# EAGLE schematic cpu_module (EAGLE 6.4)

## Sheet 1 of 3: Power Supply
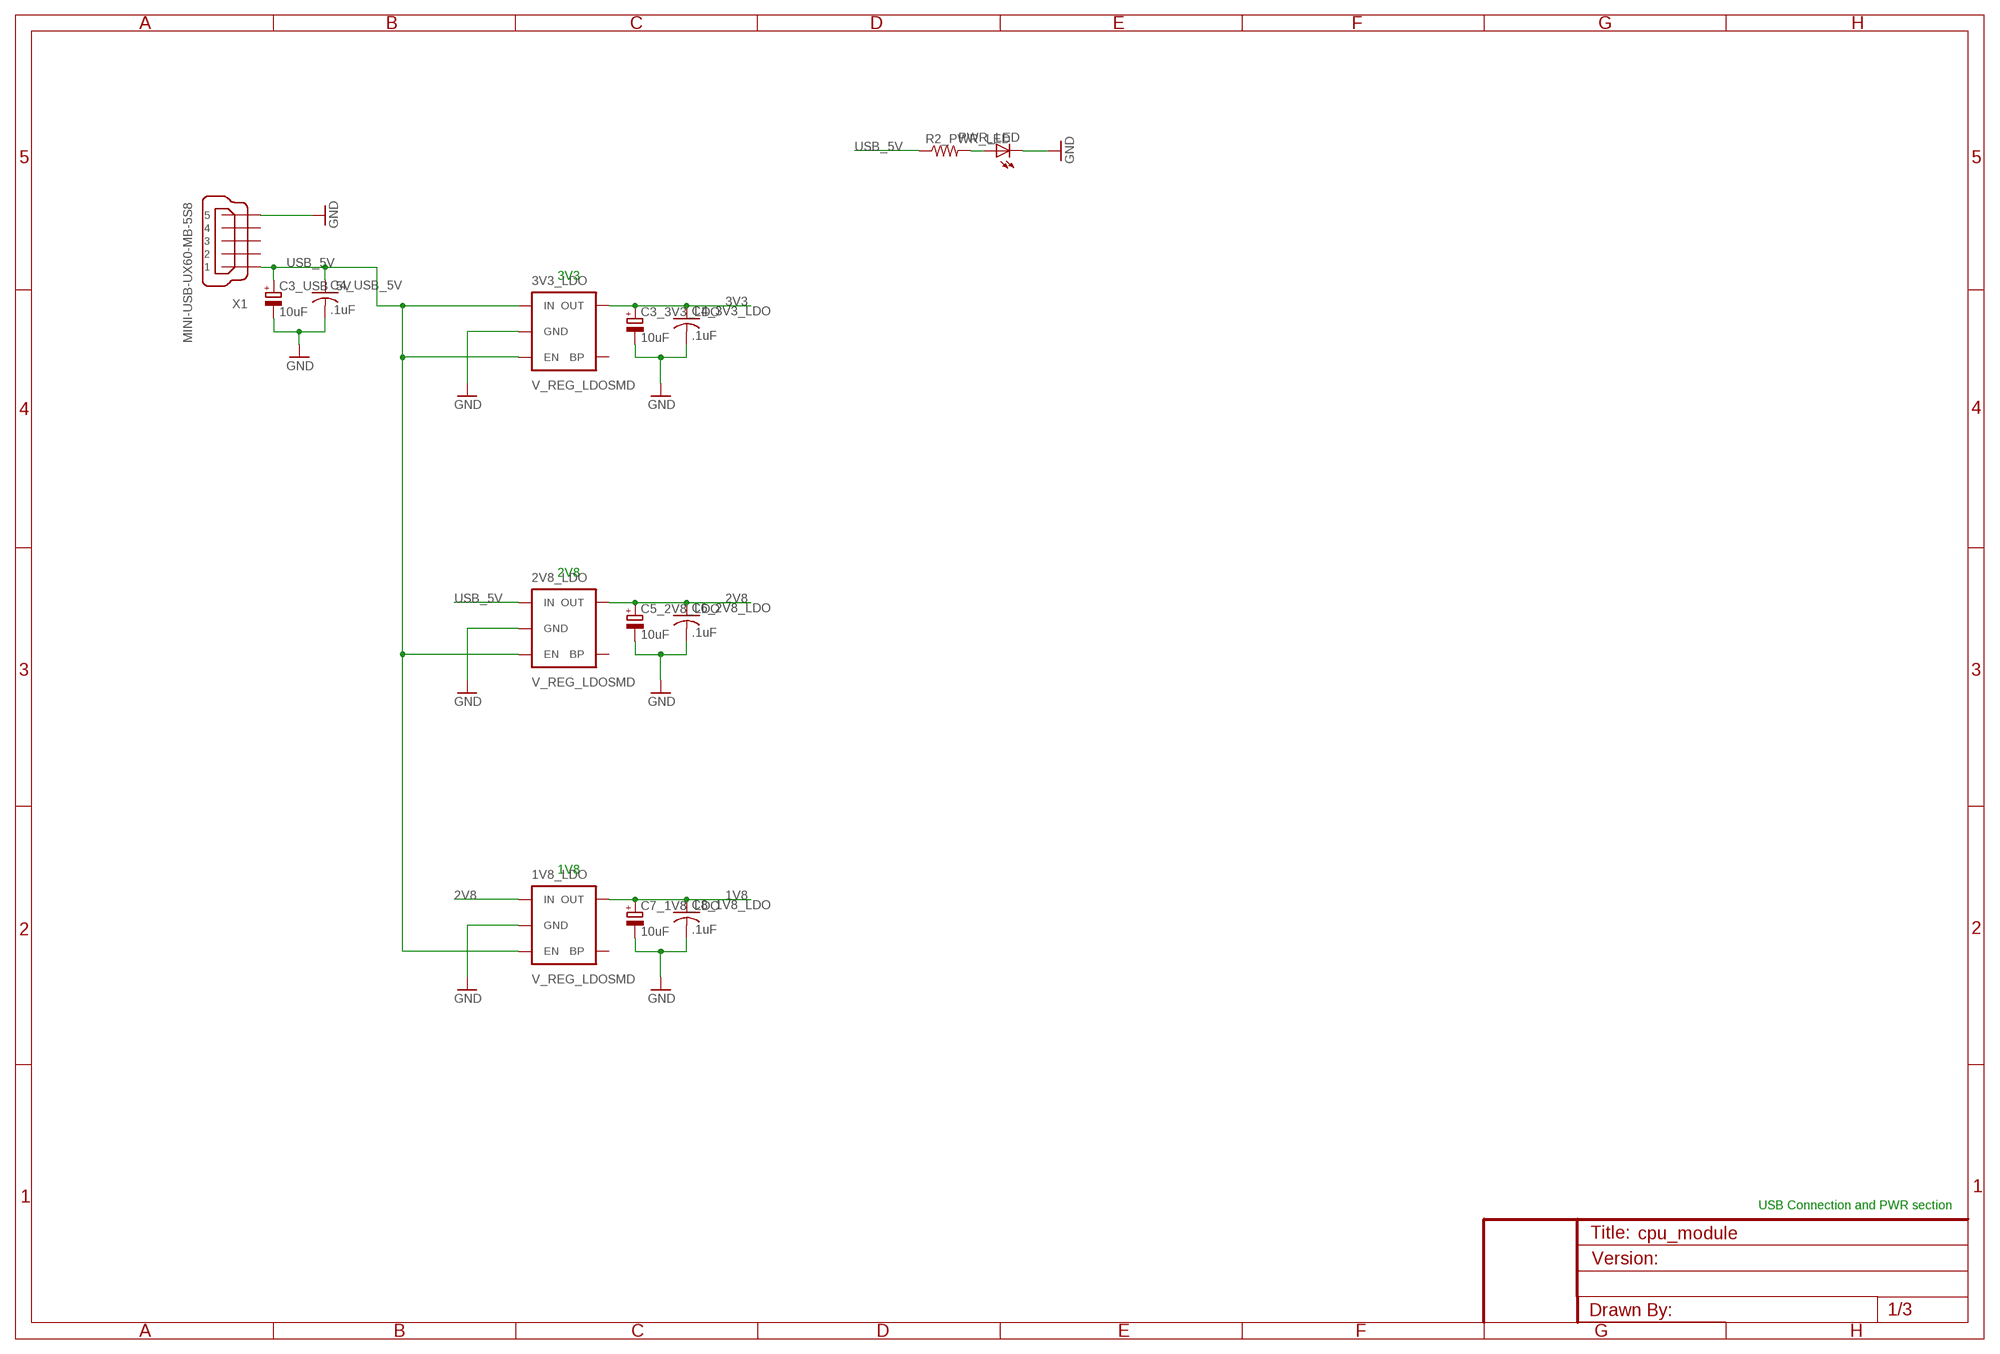
[diagram p0: schematic, sheet 1]

### Parts
1V8_LDO  V_REG_LDOSMD  [SOT23-5]
2V8_LDO  V_REG_LDOSMD  [SOT23-5]
3V3_LDO  V_REG_LDOSMD  [SOT23-5]
C3_3V3_LDO  10uF  CAPACITOR_POL-SMC_A  [SMC_A]
C3_USB_5V  10uF  CAPACITOR_POL-SMC_A  [SMC_A]
C4_3V3_LDO  .1uF  C-USC0402  [C0402]
C4_USB_5V  .1uF  C-USC0402  [C0402]
C5_2V8_LDO  10uF  CAPACITOR_POL-SMC_A  [SMC_A]
C6_2V8_LDO  .1uF  C-USC0402  [C0402]
C7_1V8_LDO  10uF  CAPACITOR_POL-SMC_A  [SMC_A]
C8_1V8_LDO  .1uF  C-USC0402  [C0402]
PWR_LED  LEDCHIP-LED0603  [CHIP-LED0603]
R2_PWR_LED  RESISTOR0402-RES  [0402-RES]
X1  MINI-USB-UX60-MB-5S8  [UX60-MB-5S8]

### Nets
1V8: 1V8_LDO.5(OUT) C7_1V8_LDO.+ C8_1V8_LDO.1 ; also sheet 3
2V8: 1V8_LDO.1(IN) 2V8_LDO.5(OUT) C5_2V8_LDO.+ C6_2V8_LDO.1 ; also sheet 3
3V3: 3V3_LDO.5(OUT) C3_3V3_LDO.+ C4_3V3_LDO.1 ; also sheet 2,3
GND: 1V8_LDO.2(GND) 2V8_LDO.2(GND) 3V3_LDO.2(GND) C3_3V3_LDO.- C3_USB_5V.- C4_3V3_LDO.2 C4_USB_5V.2 C5_2V8_LDO.- C6_2V8_LDO.2 C7_1V8_LDO.- C8_1V8_LDO.2 PWR_LED.C X1.5 ; also sheet 2,3
N$1: PWR_LED.A R2_PWR_LED.2
USB_5V: 1V8_LDO.3(EN) 2V8_LDO.1(IN) 2V8_LDO.3(EN) 3V3_LDO.1(IN) 3V3_LDO.3(EN) C3_USB_5V.+ C4_USB_5V.1 R2_PWR_LED.1 X1.1 ; also sheet 3
Unconnected: 1V8_LDO.4(BP) 2V8_LDO.4(BP) 3V3_LDO.4(BP) X1.2 X1.3 X1.4

### Notes on the sheet
- 3V3
- 2V8
- 1V8
- USB Connection and PWR section

## Sheet 2 of 3: STM32F439IIT
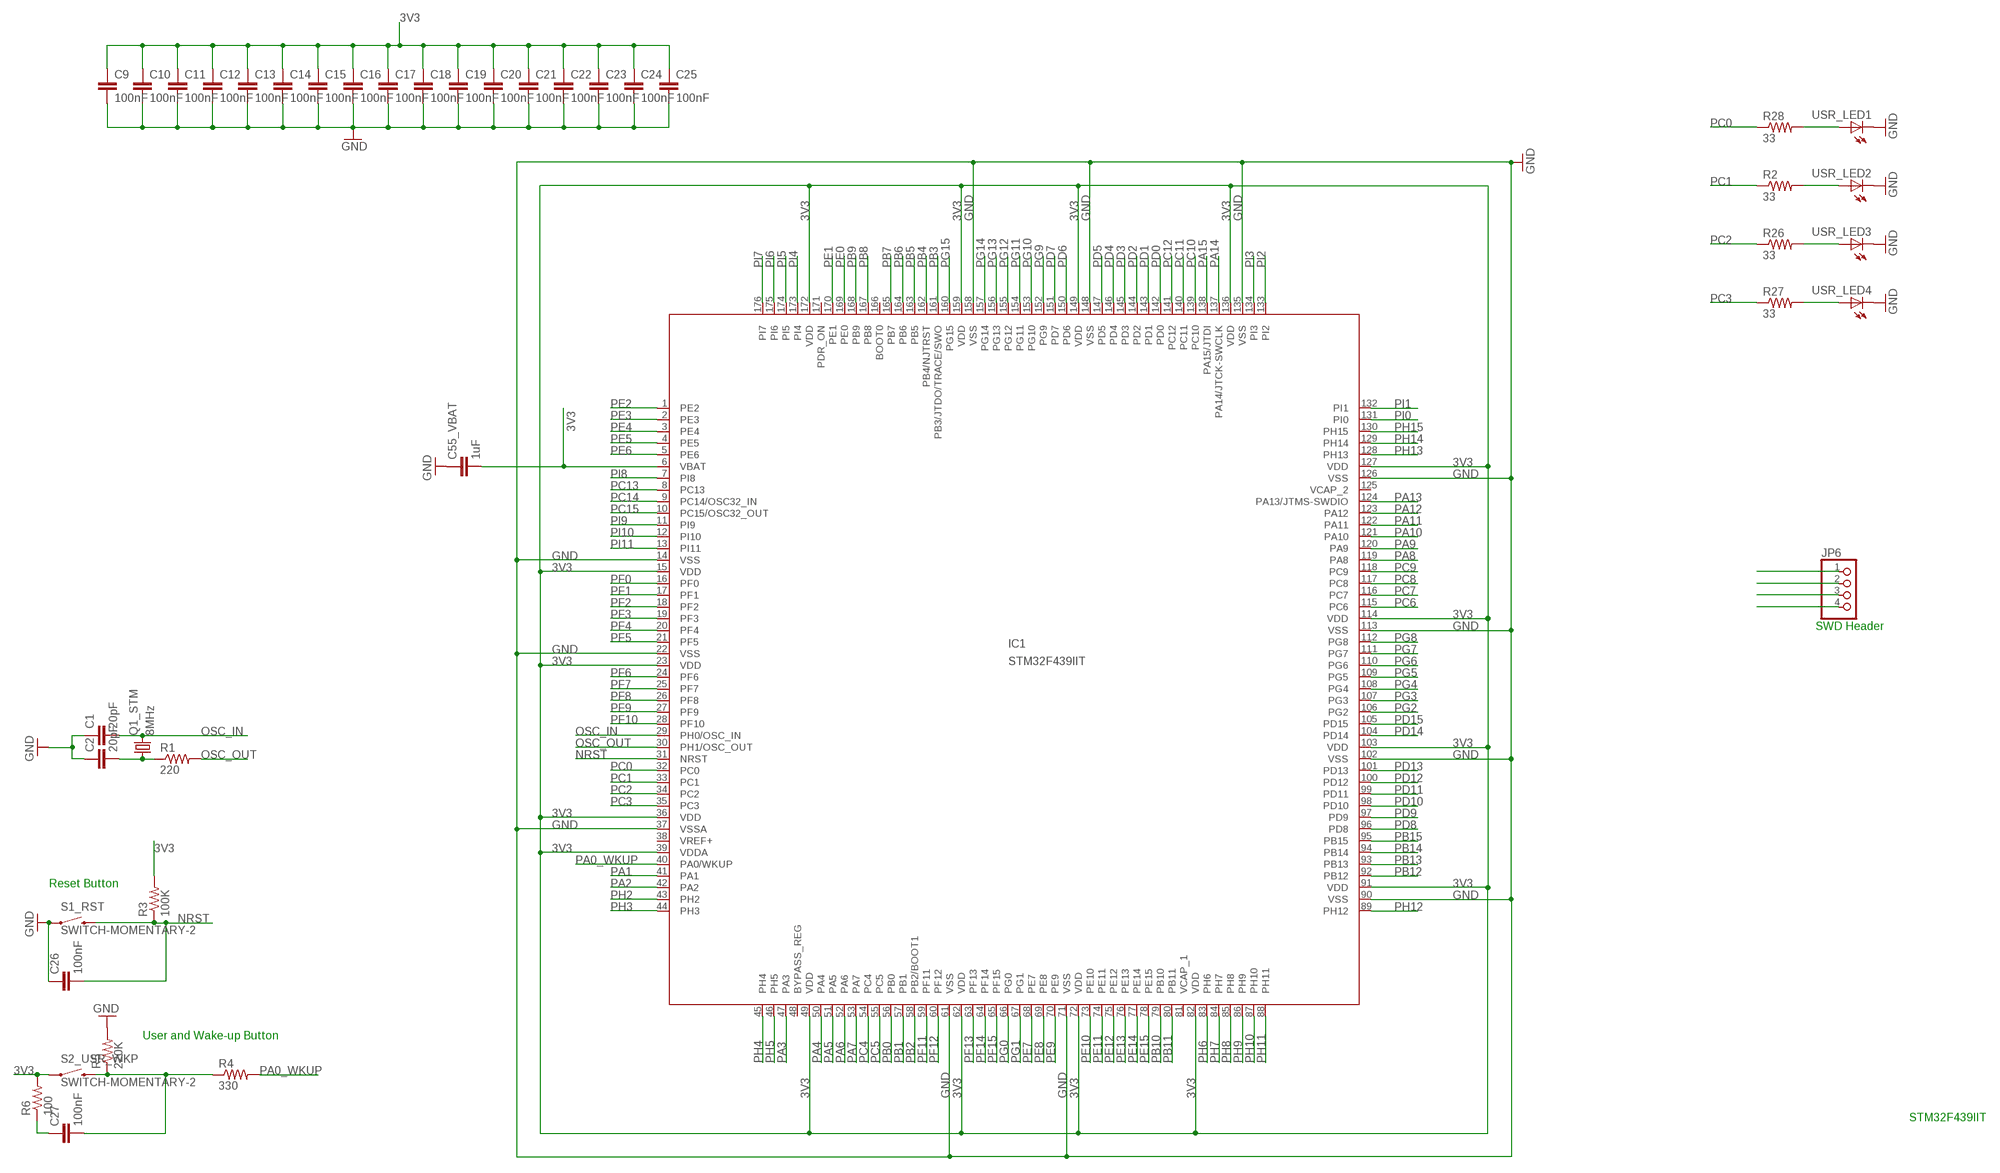
[diagram p1: schematic, sheet 2]

### Parts
C1  20pF  C-EUC0402  [C0402]
C2  20pF  C-EUC0402  [C0402]
C9  100nF  C-EUC0402  [C0402]
C10  100nF  C-EUC0402  [C0402]
C11  100nF  C-EUC0402  [C0402]
C12  100nF  C-EUC0402  [C0402]
C13  100nF  C-EUC0402  [C0402]
C14  100nF  C-EUC0402  [C0402]
C15  100nF  C-EUC0402  [C0402]
C16  100nF  C-EUC0402  [C0402]
C17  100nF  C-EUC0402  [C0402]
C18  100nF  C-EUC0402  [C0402]
C19  100nF  C-EUC0402  [C0402]
C20  100nF  C-EUC0402  [C0402]
C21  100nF  C-EUC0402  [C0402]
C22  100nF  C-EUC0402  [C0402]
C23  100nF  C-EUC0402  [C0402]
C24  100nF  C-EUC0402  [C0402]
C25  100nF  C-EUC0402  [C0402]
C26  100nF  C-EUC0402  [C0402]
C27  100nF  C-EUC0402  [C0402]
C55_VBAT  1uF  C-EUC0402  [C0402]
IC1  STM32F439IIT  [LQFP-176]
JP6  PINHD-1X4/90  [1X04/90]
Q1_STM  8MHz  CRYSTALCTS406  [CTS406]
R1  220  RESISTOR0402-RES  [0402-RES]
R2  33  RESISTOR0402-RES  [0402-RES]
R3  100K  RESISTOR0402-RES  [0402-RES]
R4  330  RESISTOR0402-RES  [0402-RES]
R5  220K  RESISTOR0402-RES  [0402-RES]
R6  100  RESISTOR0402-RES  [0402-RES]
R26  33  RESISTOR0402-RES  [0402-RES]
R27  33  RESISTOR0402-RES  [0402-RES]
R28  33  RESISTOR0402-RES  [0402-RES]
S1_RST  SWITCH-MOMENTARY-2  [TACTILE_SWITCH_TALL]
S2_USR_WKP  SWITCH-MOMENTARY-2  [TACTILE_SWITCH_TALL]
USR_LED1  LEDCHIPLED_0805  [CHIPLED_0805]
USR_LED2  LEDCHIPLED_0805  [CHIPLED_0805]
USR_LED3  LEDCHIPLED_0805  [CHIPLED_0805]
USR_LED4  LEDCHIPLED_0805  [CHIPLED_0805]

### Nets
3V3: C9.1 C10.1 C11.1 C12.1 C13.1 C14.1 C15.1 C16.1 C17.1 C18.1 C19.1 C20.1 C21.1 C22.1 C23.1 C24.1 C25.1 C55_VBAT.2 IC1.6(VBAT) IC1.15(VDD) IC1.23(VDD) IC1.36(VDD) IC1.39(VDDA) IC1.49(VDD) IC1.62(VDD) IC1.72(VDD) IC1.82(VDD) IC1.91(VDD) IC1.103(VDD) IC1.114(VDD) IC1.127(VDD) IC1.136(VDD) IC1.149(VDD) IC1.159(VDD) IC1.172(VDD) R3.2 R6.2 S2_USR_WKP.A2 ; also sheet 1,3
GND: C1.1 C2.1 C9.2 C10.2 C11.2 C12.2 C13.2 C14.2 C15.2 C16.2 C17.2 C18.2 C19.2 C20.2 C21.2 C22.2 C23.2 C24.2 C25.2 C26.1 C55_VBAT.1 IC1.14(VSS) IC1.22(VSS) IC1.37(VSSA) IC1.61(VSS) IC1.71(VSS) IC1.90(VSS) IC1.102(VSS) IC1.113(VSS) IC1.126(VSS) IC1.135(VSS) IC1.148(VSS) IC1.158(VSS) R5.2 S1_RST.A2 USR_LED1.C USR_LED2.C USR_LED3.C USR_LED4.C ; also sheet 1,3
N$2: C2.2 Q1_STM.1 R1.1
N$3: C27.2 R4.1 R5.1 S2_USR_WKP.B2
N$4: C27.1 R6.1
N$17: JP6.1
N$18: JP6.2
N$19: R28.2 USR_LED1.A
N$20: R2.2 USR_LED2.A
N$21: R26.2 USR_LED3.A
N$22: R27.2 USR_LED4.A
N$23: JP6.3
N$24: JP6.4
NRST: C26.2 IC1.31(NRST) R3.1 S1_RST.B2 ; also sheet 3
OSC_IN: C1.2 IC1.29(PH0/OSC_IN) Q1_STM.3
OSC_OUT: IC1.30(PH1/OSC_OUT) R1.2
PA0_WKUP: IC1.40(PA0/WKUP) R4.2
PA1: IC1.41(PA1) ; also sheet 3
PA2: IC1.42(PA2) ; also sheet 3
PA3: IC1.47(PA3) ; also sheet 3
PA4: IC1.50(PA4) ; also sheet 3
PA5: IC1.51(PA5) ; also sheet 3
PA6: IC1.52(PA6) ; also sheet 3
PA7: IC1.53(PA7) ; also sheet 3
PA8: IC1.119(PA8) ; also sheet 3
PA9: IC1.120(PA9) ; also sheet 3
PA10: IC1.121(PA10) ; also sheet 3
PA11: IC1.122(PA11) ; also sheet 3
PA12: IC1.123(PA12) ; also sheet 3
PA13: IC1.124(PA13/JTMS-SWDIO) ; also sheet 3
PA14: IC1.137(PA14/JTCK-SWCLK) ; also sheet 3
PA15: IC1.138(PA15/JTDI) ; also sheet 3
PB0: IC1.56(PB0) ; also sheet 3
PB1: IC1.57(PB1) ; also sheet 3
PB2: IC1.58(PB2/BOOT1) ; also sheet 3
PB3: IC1.161(PB3/JTDO/TRACE/SWO) ; also sheet 3
PB4: IC1.162(PB4/NJTRST) ; also sheet 3
PB5: IC1.163(PB5) ; also sheet 3
PB6: IC1.164(PB6) ; also sheet 3
PB7: IC1.165(PB7) ; also sheet 3
PB8: IC1.167(PB8) ; also sheet 3
PB9: IC1.168(PB9) ; also sheet 3
PB10: IC1.79(PB10) ; also sheet 3
PB11: IC1.80(PB11) ; also sheet 3
PB12: IC1.92(PB12) ; also sheet 3
PB13: IC1.93(PB13) ; also sheet 3
PB14: IC1.94(PB14) ; also sheet 3
PB15: IC1.95(PB15) ; also sheet 3
PC0: IC1.32(PC0) R28.1 ; also sheet 3
PC1: IC1.33(PC1) R2.1 ; also sheet 3
PC2: IC1.34(PC2) R26.1 ; also sheet 3
PC3: IC1.35(PC3) R27.1 ; also sheet 3
PC4: IC1.54(PC4) ; also sheet 3
PC5: IC1.55(PC5) ; also sheet 3
PC6: IC1.115(PC6) ; also sheet 3
PC7: IC1.116(PC7) ; also sheet 3
PC8: IC1.117(PC8) ; also sheet 3
PC9: IC1.118(PC9) ; also sheet 3
PC10: IC1.139(PC10) ; also sheet 3
PC11: IC1.140(PC11) ; also sheet 3
PC12: IC1.141(PC12) ; also sheet 3
PC13: IC1.8(PC13) ; also sheet 3
PC14: IC1.9(PC14/OSC32_IN) ; also sheet 3
PC15: IC1.10(PC15/OSC32_OUT) ; also sheet 3
PD0: IC1.142(PD0) ; also sheet 3
PD1: IC1.143(PD1) ; also sheet 3
PD2: IC1.144(PD2) ; also sheet 3
PD3: IC1.145(PD3) ; also sheet 3
PD4: IC1.146(PD4) ; also sheet 3
PD5: IC1.147(PD5) ; also sheet 3
PD6: IC1.150(PD6) ; also sheet 3
PD7: IC1.151(PD7) ; also sheet 3
PD8: IC1.96(PD8) ; also sheet 3
PD9: IC1.97(PD9) ; also sheet 3
PD10: IC1.98(PD10) ; also sheet 3
PD11: IC1.99(PD11) ; also sheet 3
PD12: IC1.100(PD12) ; also sheet 3
PD13: IC1.101(PD13) ; also sheet 3
PD14: IC1.104(PD14) ; also sheet 3
PD15: IC1.105(PD15) ; also sheet 3
PE0: IC1.169(PE0) ; also sheet 3
PE1: IC1.170(PE1) ; also sheet 3
PE2: IC1.1(PE2) ; also sheet 3
PE3: IC1.2(PE3) ; also sheet 3
PE4: IC1.3(PE4) ; also sheet 3
PE5: IC1.4(PE5) ; also sheet 3
PE6: IC1.5(PE6) ; also sheet 3
PE7: IC1.68(PE7) ; also sheet 3
PE8: IC1.69(PE8) ; also sheet 3
PE9: IC1.70(PE9) ; also sheet 3
PE10: IC1.73(PE10) ; also sheet 3
PE11: IC1.74(PE11) ; also sheet 3
PE12: IC1.75(PE12) ; also sheet 3
PE13: IC1.76(PE13) ; also sheet 3
PE14: IC1.77(PE14) ; also sheet 3
PE15: IC1.78(PE15) ; also sheet 3
PF0: IC1.16(PF0) ; also sheet 3
PF1: IC1.17(PF1) ; also sheet 3
PF2: IC1.18(PF2) ; also sheet 3
PF3: IC1.19(PF3) ; also sheet 3
PF4: IC1.20(PF4) ; also sheet 3
PF5: IC1.21(PF5) ; also sheet 3
PF6: IC1.24(PF6) ; also sheet 3
PF7: IC1.25(PF7) ; also sheet 3
PF8: IC1.26(PF8) ; also sheet 3
PF9: IC1.27(PF9) ; also sheet 3
PF10: IC1.28(PF10) ; also sheet 3
PF11: IC1.59(PF11) ; also sheet 3
PF12: IC1.60(PF12) ; also sheet 3
PF13: IC1.63(PF13) ; also sheet 3
PF14: IC1.64(PF14) ; also sheet 3
PF15: IC1.65(PF15) ; also sheet 3
PG0: IC1.66(PG0) ; also sheet 3
PG1: IC1.67(PG1) ; also sheet 3
PG2: IC1.106(PG2) ; also sheet 3
PG3: IC1.107(PG3) ; also sheet 3
PG4: IC1.108(PG4) ; also sheet 3
PG5: IC1.109(PG5) ; also sheet 3
PG6: IC1.110(PG6) ; also sheet 3
PG7: IC1.111(PG7) ; also sheet 3
PG8: IC1.112(PG8) ; also sheet 3
PG9: IC1.152(PG9) ; also sheet 3
PG10: IC1.153(PG10) ; also sheet 3
PG11: IC1.154(PG11) ; also sheet 3
PG12: IC1.155(PG12) ; also sheet 3
PG13: IC1.156(PG13) ; also sheet 3
PG14: IC1.157(PG14) ; also sheet 3
PG15: IC1.160(PG15) ; also sheet 3
PH2: IC1.43(PH2) ; also sheet 3
PH3: IC1.44(PH3) ; also sheet 3
PH4: IC1.45(PH4) ; also sheet 3
PH5: IC1.46(PH5) ; also sheet 3
PH6: IC1.83(PH6) ; also sheet 3
PH7: IC1.84(PH7) ; also sheet 3
PH8: IC1.85(PH8) ; also sheet 3
PH9: IC1.86(PH9) ; also sheet 3
PH10: IC1.87(PH10) ; also sheet 3
PH11: IC1.88(PH11) ; also sheet 3
PH12: IC1.89(PH12) ; also sheet 3
PH13: IC1.128(PH13) ; also sheet 3
PH14: IC1.129(PH14) ; also sheet 3
PH15: IC1.130(PH15) ; also sheet 3
PI0: IC1.131(PI0) ; also sheet 3
PI1: IC1.132(PI1) ; also sheet 3
PI2: IC1.133(PI2) ; also sheet 3
PI3: IC1.134(PI3) ; also sheet 3
PI4: IC1.173(PI4) ; also sheet 3
PI5: IC1.174(PI5) ; also sheet 3
PI6: IC1.175(PI6) ; also sheet 3
PI7: IC1.176(PI7) ; also sheet 3
PI8: IC1.7(PI8) ; also sheet 3
PI9: IC1.11(PI9) ; also sheet 3
PI10: IC1.12(PI10) ; also sheet 3
PI11: IC1.13(PI11) ; also sheet 3
Unconnected: IC1.48(BYPASS_REG) IC1.166(BOOT0)

### Notes on the sheet
- SWD Header
- Reset Button
- User and Wake-up Button
- STM32F439IIT

## Sheet 3 of 3: Header Pins
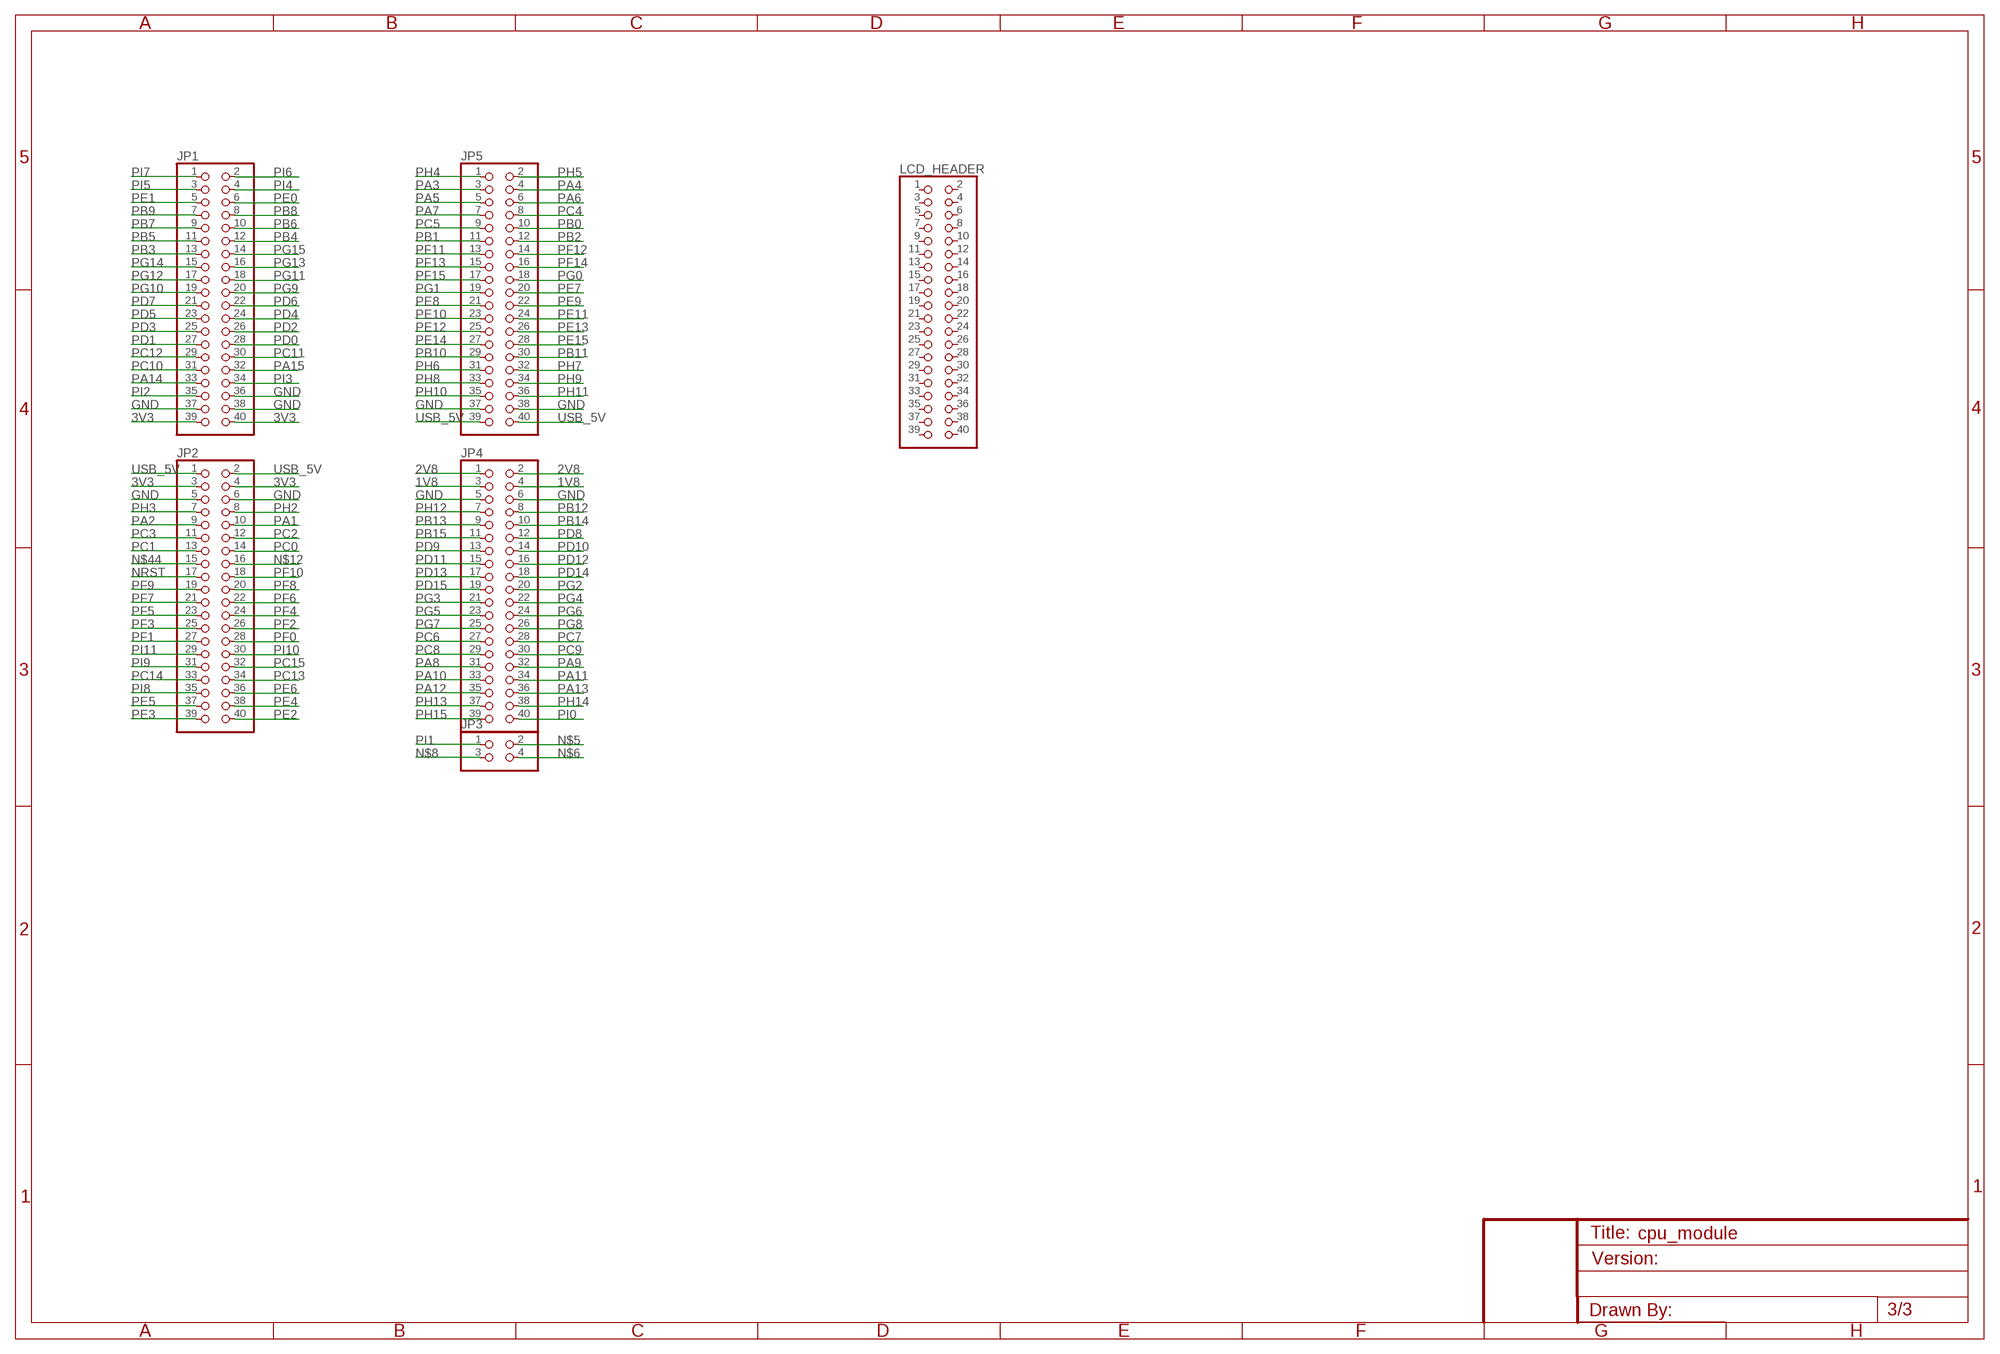
[diagram p2: schematic, sheet 3]

### Parts
JP1  PINHD-2X20  [2X20]
JP2  PINHD-2X20  [2X20]
JP3  PINHD-2X2  [2X02]
JP4  PINHD-2X20  [2X20]
JP5  PINHD-2X20  [2X20]
LCD_HEADER  PINHD-2X20  [2X20]

### Nets
1V8: JP4.3 JP4.4 ; also sheet 1
2V8: JP4.1 JP4.2 ; also sheet 1
3V3: JP1.39 JP1.40 JP2.3 JP2.4 ; also sheet 1,2
GND: JP1.36 JP1.37 JP1.38 JP2.5 JP2.6 JP4.5 JP4.6 JP5.37 JP5.38 ; also sheet 1,2
N$5: JP3.2
N$6: JP3.4
N$8: JP3.3
N$12: JP2.16
N$44: JP2.15
NRST: JP2.17 ; also sheet 2
PA1: JP2.10 ; also sheet 2
PA2: JP2.9 ; also sheet 2
PA3: JP5.3 ; also sheet 2
PA4: JP5.4 ; also sheet 2
PA5: JP5.5 ; also sheet 2
PA6: JP5.6 ; also sheet 2
PA7: JP5.7 ; also sheet 2
PA8: JP4.31 ; also sheet 2
PA9: JP4.32 ; also sheet 2
PA10: JP4.33 ; also sheet 2
PA11: JP4.34 ; also sheet 2
PA12: JP4.35 ; also sheet 2
PA13: JP4.36 ; also sheet 2
PA14: JP1.33 ; also sheet 2
PA15: JP1.32 ; also sheet 2
PB0: JP5.10 ; also sheet 2
PB1: JP5.11 ; also sheet 2
PB2: JP5.12 ; also sheet 2
PB3: JP1.13 ; also sheet 2
PB4: JP1.12 ; also sheet 2
PB5: JP1.11 ; also sheet 2
PB6: JP1.10 ; also sheet 2
PB7: JP1.9 ; also sheet 2
PB8: JP1.8 ; also sheet 2
PB9: JP1.7 ; also sheet 2
PB10: JP5.29 ; also sheet 2
PB11: JP5.30 ; also sheet 2
PB12: JP4.8 ; also sheet 2
PB13: JP4.9 ; also sheet 2
PB14: JP4.10 ; also sheet 2
PB15: JP4.11 ; also sheet 2
PC0: JP2.14 ; also sheet 2
PC1: JP2.13 ; also sheet 2
PC2: JP2.12 ; also sheet 2
PC3: JP2.11 ; also sheet 2
PC4: JP5.8 ; also sheet 2
PC5: JP5.9 ; also sheet 2
PC6: JP4.27 ; also sheet 2
PC7: JP4.28 ; also sheet 2
PC8: JP4.29 ; also sheet 2
PC9: JP4.30 ; also sheet 2
PC10: JP1.31 ; also sheet 2
PC11: JP1.30 ; also sheet 2
PC12: JP1.29 ; also sheet 2
PC13: JP2.34 ; also sheet 2
PC14: JP2.33 ; also sheet 2
PC15: JP2.32 ; also sheet 2
PD0: JP1.28 ; also sheet 2
PD1: JP1.27 ; also sheet 2
PD2: JP1.26 ; also sheet 2
PD3: JP1.25 ; also sheet 2
PD4: JP1.24 ; also sheet 2
PD5: JP1.23 ; also sheet 2
PD6: JP1.22 ; also sheet 2
PD7: JP1.21 ; also sheet 2
PD8: JP4.12 ; also sheet 2
PD9: JP4.13 ; also sheet 2
PD10: JP4.14 ; also sheet 2
PD11: JP4.15 ; also sheet 2
PD12: JP4.16 ; also sheet 2
PD13: JP4.17 ; also sheet 2
PD14: JP4.18 ; also sheet 2
PD15: JP4.19 ; also sheet 2
PE0: JP1.6 ; also sheet 2
PE1: JP1.5 ; also sheet 2
PE2: JP2.40 ; also sheet 2
PE3: JP2.39 ; also sheet 2
PE4: JP2.38 ; also sheet 2
PE5: JP2.37 ; also sheet 2
PE6: JP2.36 ; also sheet 2
PE7: JP5.20 ; also sheet 2
PE8: JP5.21 ; also sheet 2
PE9: JP5.22 ; also sheet 2
PE10: JP5.23 ; also sheet 2
PE11: JP5.24 ; also sheet 2
PE12: JP5.25 ; also sheet 2
PE13: JP5.26 ; also sheet 2
PE14: JP5.27 ; also sheet 2
PE15: JP5.28 ; also sheet 2
PF0: JP2.28 ; also sheet 2
PF1: JP2.27 ; also sheet 2
PF2: JP2.26 ; also sheet 2
PF3: JP2.25 ; also sheet 2
PF4: JP2.24 ; also sheet 2
PF5: JP2.23 ; also sheet 2
PF6: JP2.22 ; also sheet 2
PF7: JP2.21 ; also sheet 2
PF8: JP2.20 ; also sheet 2
PF9: JP2.19 ; also sheet 2
PF10: JP2.18 ; also sheet 2
PF11: JP5.13 ; also sheet 2
PF12: JP5.14 ; also sheet 2
PF13: JP5.15 ; also sheet 2
PF14: JP5.16 ; also sheet 2
PF15: JP5.17 ; also sheet 2
PG0: JP5.18 ; also sheet 2
PG1: JP5.19 ; also sheet 2
PG2: JP4.20 ; also sheet 2
PG3: JP4.21 ; also sheet 2
PG4: JP4.22 ; also sheet 2
PG5: JP4.23 ; also sheet 2
PG6: JP4.24 ; also sheet 2
PG7: JP4.25 ; also sheet 2
PG8: JP4.26 ; also sheet 2
PG9: JP1.20 ; also sheet 2
PG10: JP1.19 ; also sheet 2
PG11: JP1.18 ; also sheet 2
PG12: JP1.17 ; also sheet 2
PG13: JP1.16 ; also sheet 2
PG14: JP1.15 ; also sheet 2
PG15: JP1.14 ; also sheet 2
PH2: JP2.8 ; also sheet 2
PH3: JP2.7 ; also sheet 2
PH4: JP5.1 ; also sheet 2
PH5: JP5.2 ; also sheet 2
PH6: JP5.31 ; also sheet 2
PH7: JP5.32 ; also sheet 2
PH8: JP5.33 ; also sheet 2
PH9: JP5.34 ; also sheet 2
PH10: JP5.35 ; also sheet 2
PH11: JP5.36 ; also sheet 2
PH12: JP4.7 ; also sheet 2
PH13: JP4.37 ; also sheet 2
PH14: JP4.38 ; also sheet 2
PH15: JP4.39 ; also sheet 2
PI0: JP4.40 ; also sheet 2
PI1: JP3.1 ; also sheet 2
PI2: JP1.35 ; also sheet 2
PI3: JP1.34 ; also sheet 2
PI4: JP1.4 ; also sheet 2
PI5: JP1.3 ; also sheet 2
PI6: JP1.2 ; also sheet 2
PI7: JP1.1 ; also sheet 2
PI8: JP2.35 ; also sheet 2
PI9: JP2.31 ; also sheet 2
PI10: JP2.30 ; also sheet 2
PI11: JP2.29 ; also sheet 2
USB_5V: JP2.1 JP2.2 JP5.39 JP5.40 ; also sheet 1
Unconnected: LCD_HEADER.1 LCD_HEADER.2 LCD_HEADER.3 LCD_HEADER.4 LCD_HEADER.5 LCD_HEADER.6 LCD_HEADER.7 LCD_HEADER.8 LCD_HEADER.9 LCD_HEADER.10 LCD_HEADER.11 LCD_HEADER.12 LCD_HEADER.13 LCD_HEADER.14 LCD_HEADER.15 LCD_HEADER.16 LCD_HEADER.17 LCD_HEADER.18 LCD_HEADER.19 LCD_HEADER.20 LCD_HEADER.21 LCD_HEADER.22 LCD_HEADER.23 LCD_HEADER.24 LCD_HEADER.25 LCD_HEADER.26 LCD_HEADER.27 LCD_HEADER.28 LCD_HEADER.29 LCD_HEADER.30 LCD_HEADER.31 LCD_HEADER.32 LCD_HEADER.33 LCD_HEADER.34 LCD_HEADER.35 LCD_HEADER.36 LCD_HEADER.37 LCD_HEADER.38 LCD_HEADER.39 LCD_HEADER.40

## Power pins joined to a net without a drawn wire
PDR_ON: IC1.171(PDR_ON)
VCAP_1: IC1.81(VCAP_1)
VCAP_2: IC1.125(VCAP_2)
VREF+: IC1.38(VREF+)

## Library data of the parts
1V8_LDO 2V8_LDO 3V3_LDO = SparkFun-PowerIC:V_REG_LDO: Voltage Regulator LDO Standard 150mA LDO voltage regulator in SOT-23 layout. Micrel part MIC5205. BP (by-pass) pin is used to lower output noise with 470pF cap.
C1 C2 = resistor:C-EU: CAPACITOR, European symbol
C3_3V3_LDO C3_USB_5V C5_2V8_LDO C7_1V8_LDO = dp_devices:CAPACITOR_POL: Polarized capacitor in various packages
C4_3V3_LDO C4_USB_5V C6_2V8_LDO C8_1V8_LDO = rcl:C-US: CAPACITOR, American symbol
C9-C27 C55_VBAT = rcl:C-EU: CAPACITOR, European symbol
IC1 = STM32F439IIT:STM32F439IIT: edit this description Auto generated by make-symbol-device-package-bsdl.ulp Rev. 43 Source:
JP1 JP2 JP4 JP5 LCD_HEADER = pinhead:PINHD-2X20: PIN HEADER
JP3 = pinhead:PINHD-2X2: PIN HEADER
JP6 = pinhead:PINHD-1X4: PIN HEADER
PWR_LED = led:LED: LED
Q1_STM = crystal:CRYSTAL: CRYSTAL; OC_FARNELL: unknown; OC_NEWARK: unknown
R1 R2 R2_PWR_LED R3-R6 R26-R28 = SparkFun-Passives:RESISTOR: Resistor Basic schematic elements and footprints for 0603, 1206, and PTH resistors.
S1_RST S2_USR_WKP = SparkFun-Electromechanical:SWITCH-MOMENTARY-2: Various NO switches- pushbuttons, reed, etc
USR_LED1-USR_LED4 = adafruit:LED: LED
X1 = con-hirose:MINI-USB-: MINI USB Connector Source: http://www.hirose.co.jp/cataloge_hp/e24000019.pdf; OC_FARNELL: unknown; OC_NEWARK: unknown